# Altium project SM3320-BATT-EV.PrjPCB
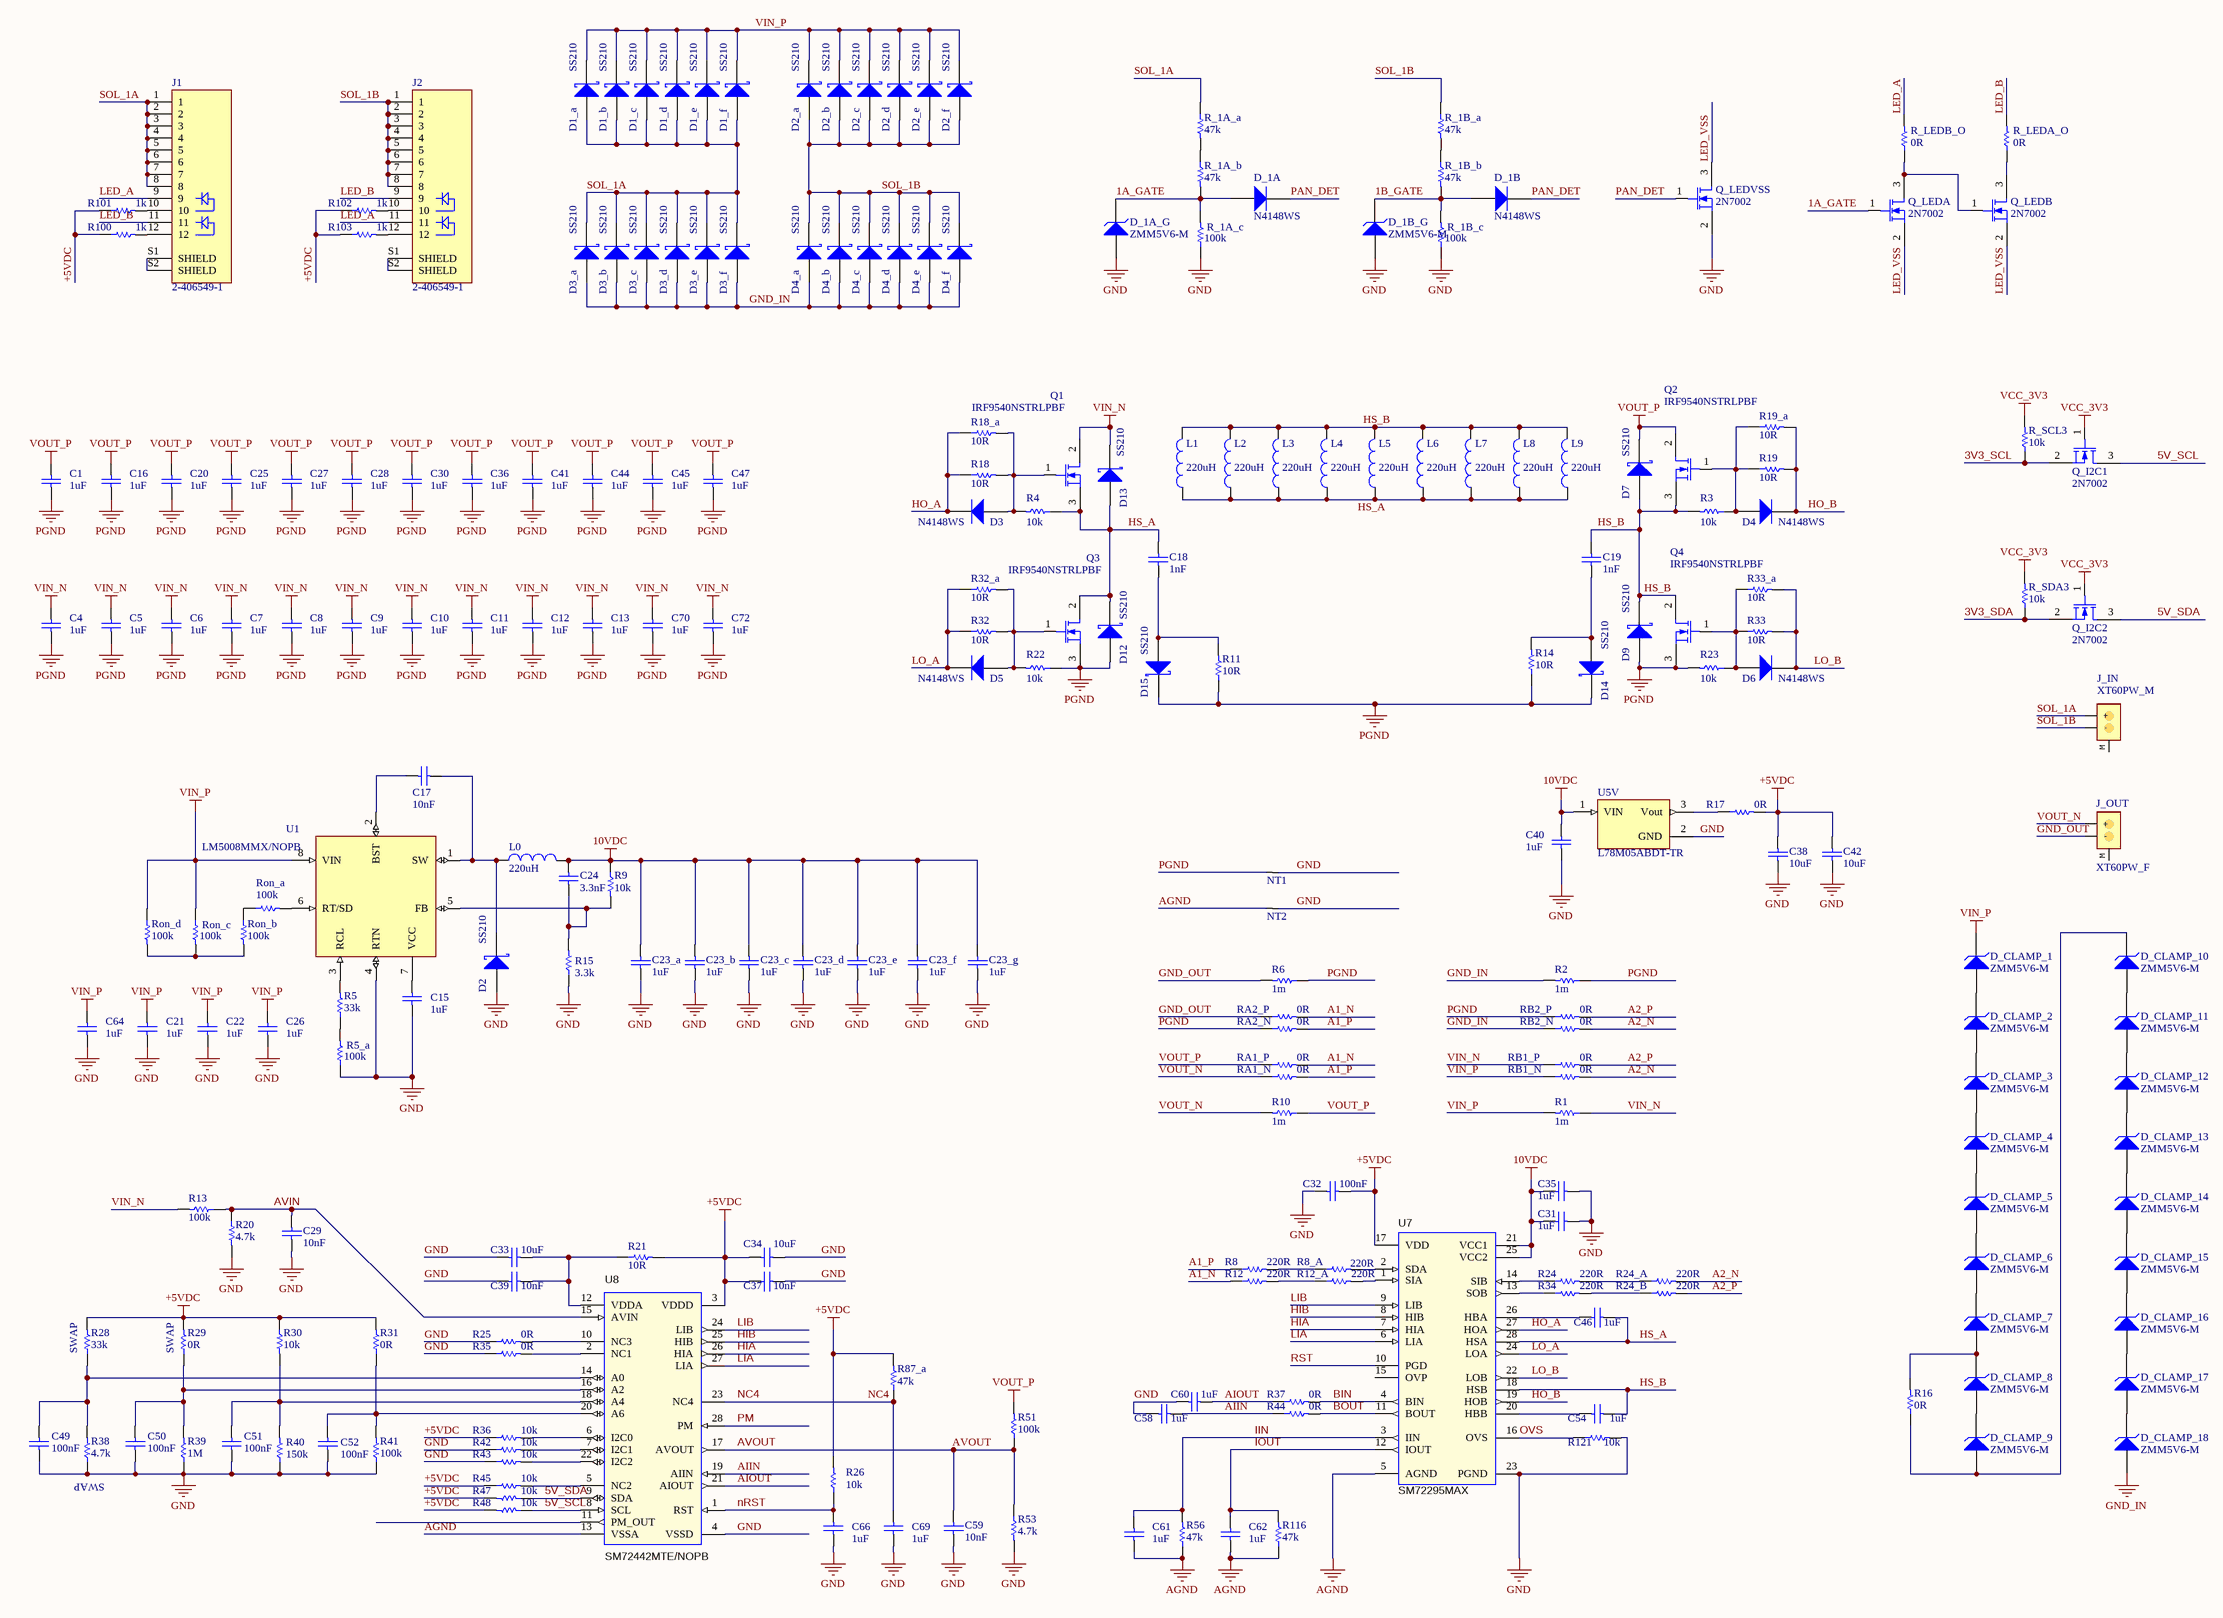
[diagram p0: SM3320-BATT-EV.SchDoc]
PCB_CopperRev: 001; PCB_MinorRev: -001 REV A; PCB_SilkRev: REV A; PRJ_BasePN: 600556; PRJ_Customer: National Semiconductor; PRJ_Title: SM3320-BATT-EV; SCH_Rev: X1; TechSupport: http://www.national.com/support
1 sheet, 236 parts. Net scope: global (net labels, ports and power ports of the same name join across sheets).
Board file: SM3320-BATT-EV.PcbDoc

## Sheet SM3320-BATT-EV.SchDoc: ChangeMe
size C; Date: Not shown in title block; ApprovedBy: Not shown in title block; CheckedBy: Not shown in title block; Author: Not shown in title block; CompanyName: Not shown in title block; DrawnBy: Not shown in title block; Engineer: Not shown in title block; Organization: Not shown in title block; Address1: Not shown in title block; Address2: Not shown in title block; Address3: Not shown in title block; Address4: Not shown in title block; DocumentNumber: 1; Revision: Use project parameter SCH_Rev; SheetNumber: 1; SheetTotal: 1; PageSetup: Record=PageOptions|CenterHorizontal=True|CenterVertical=True|PrintScale=0.85|XCorrection=0.00|YCorrection=0.00|PrintKind=2|BorderSize=5000000|LeftOffset=0|BottomOffset=0|Orientation=2|PaperLength=1000|PaperWidth=1000|Scale=100|PaperSource=15|PrintQuality=600|MediaType=1|DitherType=10|PaperKind=11x17|PrintScaleMode=0; CurrentTime: Not shown in title block; CurrentDate: Not shown in title block; Time: Not shown in title block; DocumentFullPathAndName: Not shown in title block; DocumentName: Not shown in title block; ModifiedDate: Not shown in title block; ImagePath: Not shown in title block

### Parts
C1  value 1uF  [C_1206]  (hidden comment: 1206B105K101NT)
C4  value 1uF  [C_1206]  (hidden comment: 1206B105K101NT)
C5  value 1uF  [C_1206]  (hidden comment: 1206B105K101NT)
C6  value 1uF  [C_1206]  (hidden comment: 1206B105K101NT)
C7  value 1uF  [C_1206]  (hidden comment: 1206B105K101NT)
C8  value 1uF  [C_1206]  (hidden comment: 1206B105K101NT)
C9  value 1uF  [C_1206]  (hidden comment: 1206B105K101NT)
C10  value 1uF  [C_1206]  (hidden comment: 1206B105K101NT)
C11  value 1uF  [C_1206]  (hidden comment: 1206B105K101NT)
C12  value 1uF  [C_1206]  (hidden comment: 1206B105K101NT)
C13  value 1uF  [C_1206]  (hidden comment: 1206B105K101NT)
C15  value 1uF  [C_0402]  (hidden comment: CL05A105KA5NQNC)
C16  value 1uF  [C_1206]  (hidden comment: 1206B105K101NT)
C17  value 10nF  [C_0402]  (hidden comment: CL05B103KB5NNNC)
C18  value 1nF  [C_1206]  (hidden comment: 1206B102K202NT)
C19  value 1nF  [C_1206]  (hidden comment: 1206B102K202NT)
C20  value 1uF  [C_1206]  (hidden comment: 1206B105K101NT)
C21  value 1uF  [C_1206]  (hidden comment: 1206B105K101NT)
C22  value 1uF  [C_1206]  (hidden comment: 1206B105K101NT)
C23_a  value 1uF  [C_0402]  (hidden comment: CL05A105KA5NQNC)
C23_b  value 1uF  [C_0402]  (hidden comment: CL05A105KA5NQNC)
C23_c  value 1uF  [C_0402]  (hidden comment: CL05A105KA5NQNC)
C23_d  value 1uF  [C_0402]  (hidden comment: CL05A105KA5NQNC)
C23_e  value 1uF  [C_0402]  (hidden comment: CL05A105KA5NQNC)
C23_f  value 1uF  [C_0402]  (hidden comment: CL05A105KA5NQNC)
C23_g  value 1uF  [C_0402]  (hidden comment: CL05A105KA5NQNC)
C24  value 3.3nF  [C_0402]  (hidden comment: CL05B332KB5NNNC)
C25  value 1uF  [C_1206]  (hidden comment: 1206B105K101NT)
C26  value 1uF  [C_1206]  (hidden comment: 1206B105K101NT)
C27  value 1uF  [C_1206]  (hidden comment: 1206B105K101NT)
C28  value 1uF  [C_1206]  (hidden comment: 1206B105K101NT)
C29  value 10nF  [C_0402]  (hidden comment: CL05B103KB5NNNC)
C30  value 1uF  [C_1206]  (hidden comment: 1206B105K101NT)
C31  value 1uF  [C_0402]  (hidden comment: CL05A105KA5NQNC)
C32  value 100nF  [C_0402]  (hidden comment: CL05B104KO5NNNC)
C33  value 10uF  [C_0402]  (hidden comment: CL05A106MQ5NUNC)
C34  value 10uF  [C_0402]  (hidden comment: CL05A106MQ5NUNC)
C35  value 1uF  [C_0402]  (hidden comment: CL05A105KA5NQNC)
C36  value 1uF  [C_1206]  (hidden comment: 1206B105K101NT)
C37  value 10nF  [C_0402]  (hidden comment: CL05B103KB5NNNC)
C38  value 10uF  [C_0402]  (hidden comment: CL05A106MQ5NUNC)
C39  value 10nF  [C_0402]  (hidden comment: CL05B103KB5NNNC)
C40  value 1uF  [C_0402]  (hidden comment: CL05A105KA5NQNC)
C41  value 1uF  [C_1206]  (hidden comment: 1206B105K101NT)
C42  value 10uF  [C_0402]  (hidden comment: CL05A106MQ5NUNC)
C44  value 1uF  [C_1206]  (hidden comment: 1206B105K101NT)
C45  value 1uF  [C_1206]  (hidden comment: 1206B105K101NT)
C46  value 1uF  [C_0402]  (hidden comment: CL05A105KA5NQNC)
C47  value 1uF  [C_1206]  (hidden comment: 1206B105K101NT)
C49  value 100nF  [C_0402]  (hidden comment: CL05B104KO5NNNC)
C50  value 100nF  [C_0402]  (hidden comment: CL05B104KO5NNNC)
C51  value 100nF  [C_0402]  (hidden comment: CL05B104KO5NNNC)
C52  value 100nF  [C_0402]  (hidden comment: CL05B104KO5NNNC)
C54  value 1uF  [C_0402]  (hidden comment: CL05A105KA5NQNC)
C58  value 1uF  [C_0402]  (hidden comment: CL05A105KA5NQNC)
C59  value 10nF  [C_0402]  (hidden comment: CL05B103KB5NNNC)
C60  value 1uF  [C_0402]  (hidden comment: CL05A105KA5NQNC)
C61  value 1uF  [C_0402]  (hidden comment: CL05A105KA5NQNC)
C62  value 1uF  [C_0402]  (hidden comment: CL05A105KA5NQNC)
C64  value 1uF  [C_1206]  (hidden comment: 1206B105K101NT)
C66  value 1uF  [C_0402]  (hidden comment: CL05A105KA5NQNC)
C69  value 1uF  [C_0402]  (hidden comment: CL05A105KA5NQNC)
C70  value 1uF  [C_1206]  (hidden comment: 1206B105K101NT)
C72  value 1uF  [C_1206]  (hidden comment: 1206B105K101NT)
D1_a  SS210  [DO-214AC]
D1_b  SS210  [DO-214AC]
D1_c  SS210  [DO-214AC]
D1_d  SS210  [DO-214AC]
D1_e  SS210  [DO-214AC]
D1_f  SS210  [DO-214AC]
D2  SS210  [DO-214AC]
D2_a  SS210  [DO-214AC]
D2_b  SS210  [DO-214AC]
D2_c  SS210  [DO-214AC]
D2_d  SS210  [DO-214AC]
D2_e  SS210  [DO-214AC]
D2_f  SS210  [DO-214AC]
D3  N4148WS  [SOD-323]
D3_a  SS210  [DO-214AC]
D3_b  SS210  [DO-214AC]
D3_c  SS210  [DO-214AC]
D3_d  SS210  [DO-214AC]
D3_e  SS210  [DO-214AC]
D3_f  SS210  [DO-214AC]
D4  N4148WS  [SOD-323]
D4_a  SS210  [DO-214AC]
D4_b  SS210  [DO-214AC]
D4_c  SS210  [DO-214AC]
D4_d  SS210  [DO-214AC]
D4_e  SS210  [DO-214AC]
D4_f  SS210  [DO-214AC]
D5  N4148WS  [SOD-323]
D6  N4148WS  [SOD-323]
D7  SS210  [DO-214AC]
D9  SS210  [DO-214AC]
D12  SS210  [DO-214AC]
D13  SS210  [DO-214AC]
D14  SS210  [DO-214AC]
D15  SS210  [DO-214AC]
D_1A  N4148WS  [SOD-323]
D_1A_G  ZMM5V6-M  [DO-213AA]
D_1B  N4148WS  [SOD-323]
D_1B_G  ZMM5V6-M  [DO-213AA]
D_CLAMP_1  ZMM5V6-M  [DO-213AA]
D_CLAMP_2  ZMM5V6-M  [DO-213AA]
D_CLAMP_3  ZMM5V6-M  [DO-213AA]
D_CLAMP_4  ZMM5V6-M  [DO-213AA]
D_CLAMP_5  ZMM5V6-M  [DO-213AA]
D_CLAMP_6  ZMM5V6-M  [DO-213AA]
D_CLAMP_7  ZMM5V6-M  [DO-213AA]
D_CLAMP_8  ZMM5V6-M  [DO-213AA]
D_CLAMP_9  ZMM5V6-M  [DO-213AA]
D_CLAMP_10  ZMM5V6-M  [DO-213AA]
D_CLAMP_11  ZMM5V6-M  [DO-213AA]
D_CLAMP_12  ZMM5V6-M  [DO-213AA]
D_CLAMP_13  ZMM5V6-M  [DO-213AA]
D_CLAMP_14  ZMM5V6-M  [DO-213AA]
D_CLAMP_15  ZMM5V6-M  [DO-213AA]
D_CLAMP_16  ZMM5V6-M  [DO-213AA]
D_CLAMP_17  ZMM5V6-M  [DO-213AA]
D_CLAMP_18  ZMM5V6-M  [DO-213AA]
J1  2-406549-1  [TE_2-406549-1]
J2  2-406549-1  [TE_2-406549-1]
J_IN  XT60PW_M  [XT60PW_M]
J_OUT  XT60PW_F  [XT60PW_F]
L0  value 220uH  [SRR1260]  (hidden comment: SWRB1207S-221MT)
L1  value 220uH  [SRR1260]  (hidden comment: SWRB1207S-221MT)
L2  value 220uH  [SRR1260]  (hidden comment: SWRB1207S-221MT)
L3  value 220uH  [SRR1260]  (hidden comment: SWRB1207S-221MT)
L4  value 220uH  [SRR1260]  (hidden comment: SWRB1207S-221MT)
L5  value 220uH  [SRR1260]  (hidden comment: SWRB1207S-221MT)
L6  value 220uH  [SRR1260]  (hidden comment: SWRB1207S-221MT)
L7  value 220uH  [SRR1260]  (hidden comment: SWRB1207S-221MT)
L8  value 220uH  [SRR1260]  (hidden comment: SWRB1207S-221MT)
L9  value 220uH  [SRR1260]  (hidden comment: SWRB1207S-221MT)
NT1  0  [NET_TIE]  (value not drawn)
NT2  0  [NET_TIE]  (value not drawn)
Q1  IRF9540NSTRLPBF  [TO-263-3]
Q2  IRF9540NSTRLPBF  [TO-263-3]
Q3  IRF9540NSTRLPBF  [TO-263-3]
Q4  IRF9540NSTRLPBF  [TO-263-3]
Q_I2C1  2N7002  [TO-236AB]
Q_I2C2  2N7002  [TO-236AB]
Q_LEDA  2N7002  [TO-236AB]
Q_LEDB  2N7002  [TO-236AB]
Q_LEDVSS  2N7002  [TO-236AB]
R1  1m  [R_2512]
R2  1m  [R_2512]
R3  value 10k  [R_0402]  (hidden comment: 0402WGF1002TCE)
R4  value 10k  [R_0402]  (hidden comment: 0402WGF1002TCE)
R5  value 33k  [R_0402]  (hidden comment: 0402WGF3302TCE)
R5_a  value 100k  [R_0402]  (hidden comment: 0402WGF1003TCE)
R6  1m  [R_2512]
R8  value 220R  [R_0402]  (hidden comment: 0402WGF2200TCE)
R8_A  value 220R  [R_0402]  (hidden comment: *)
R9  value 10k  [R_0402]  (hidden comment: 0402WGF1002TCE)
R10  1m  [R_2512]
R11  value 10R  [R_1206]  (hidden comment: 1206W4F100JT5E)
R12  value 220R  [R_0402]  (hidden comment: 0402WGF2200TCE)
R12_A  value 220R  [R_0402]  (hidden comment: 0402WGF2200TCE)
R13  value 100k  [R_0603]  (hidden comment: 0603WAF100KT5E)
R14  value 10R  [R_1206]  (hidden comment: 1206W4F100JT5E)
R15  value 3.3k  [R_0402]  (hidden comment: 0402WGF3301TCE)
R16  value 0R  [R_0402]  (hidden comment: 0402WGF0000TCE)
R17  value 0R  [R_0402]  (hidden comment: 0402WGF0000TCE)
R18  value 10R  [R_0402]  (hidden comment: 0402WGF100JTCE)
R18_a  value 10R  [R_0402]  (hidden comment: 0402WGF100JTCE)
R19  value 10R  [R_0402]  (hidden comment: 0402WGF100JTCE)
R19_a  value 10R  [R_0402]  (hidden comment: 0402WGF100JTCE)
R20  value 4.7k  [R_0402]  (hidden comment: 0402WGF4701TCE)
R21  value 10R  [R_0402]  (hidden comment: 0402WGF100JTCE)
R22  value 10k  [R_0402]  (hidden comment: 0402WGF1002TCE)
R23  value 10k  [R_0402]  (hidden comment: 0402WGF1002TCE)
R24  value 220R  [R_0402]  (hidden comment: 0402WGF2200TCE)
R24_A  value 220R  [R_0402]  (hidden comment: 0402WGF2200TCE)
R24_B  value 220R  [R_0402]  (hidden comment: 0402WGF2200TCE)
R25  value 0R  [R_0402]  (hidden comment: 0402WGF0000TCE)
R26  value 10k  [R_0402]  (hidden comment: 0402WGF1002TCE)
R28  value 33k  [R_0402]  (hidden comment: 0402WGF3302TCE)
R29  value 0R  [R_0402]  (hidden comment: 0402WGF0000TCE)
R30  value 10k  [R_0402]  (hidden comment: 0402WGF1002TCE)
R31  value 0R  [R_0402]  (hidden comment: 0402WGF0000TCE)
R32  value 10R  [R_0402]  (hidden comment: 0402WGF100JTCE)
R32_a  value 10R  [R_0402]  (hidden comment: 0402WGF100JTCE)
R33  value 10R  [R_0402]  (hidden comment: 0402WGF100JTCE)
R33_a  value 10R  [R_0402]  (hidden comment: 0402WGF100JTCE)
R34  value 220R  [R_0402]  (hidden comment: 0402WGF2200TCE)
R35  value 0R  [R_0402]  (hidden comment: 0402WGF0000TCE)
R36  value 10k  [R_0402]  (hidden comment: 0402WGF1002TCE)
R37  value 0R  [R_0402]  (hidden comment: 0402WGF0000TCE)
R38  value 4.7k  [R_0402]  (hidden comment: 0402WGF4701TCE)
R39  value 1M  [R_0402]  (hidden comment: 0402WGF1004TCE)
R40  value 150k  [R_0402]  (hidden comment: 0402WGF1503TCE)
R41  value 100k  [R_0402]  (hidden comment: 0402WGF1003TCE)
R42  value 10k  [R_0402]  (hidden comment: 0402WGF1002TCE)
R43  value 10k  [R_0402]  (hidden comment: 0402WGF1002TCE)
R44  value 0R  [R_0402]  (hidden comment: 0402WGF0000TCE)
R45  value 10k  [R_0402]  (hidden comment: 0402WGF1002TCE)
R47  value 10k  [R_0402]  (hidden comment: 0402WGF1002TCE)
R48  value 10k  [R_0402]  (hidden comment: 0402WGF1002TCE)
R51  value 100k  [R_0603]  (hidden comment: 0603WAF100KT5E)
R53  value 4.7k  [R_0402]  (hidden comment: 0402WGF4701TCE)
R56  value 47k  [R_0402]  (hidden comment: 0402WGF4702TCE)
R87_a  value 47k  [R_0402]  (hidden comment: 0402WGF4702TCE)
R100  value 1k  [R_0402]  (hidden comment: 0402WGF1001TCE)
R101  value 1k  [R_0402]  (hidden comment: 0402WGF1001TCE)
R102  value 1k  [R_0402]  (hidden comment: 0402WGF1001TCE)
R103  value 1k  [R_0402]  (hidden comment: 0402WGF1001TCE)
R116  value 47k  [R_0402]  (hidden comment: 0402WGF4702TCE)
R121  value 10k  [R_0402]  (hidden comment: 0402WGF1002TCE)
R_1A_a  value 47k  [R_0402]  (hidden comment: 0402WGF4702TCE)
R_1A_b  value 47k  [R_0402]  (hidden comment: 0402WGF4702TCE)
R_1A_c  value 100k  [R_0402]  (hidden comment: 0402WGF1003TCE)
R_1B_a  value 47k  [R_0402]  (hidden comment: 0402WGF4702TCE)
R_1B_b  value 47k  [R_0402]  (hidden comment: 0402WGF4702TCE)
R_1B_c  value 100k  [R_0402]  (hidden comment: 0402WGF1003TCE)
R_LEDA_O  value 0R  [R_0402]  (hidden comment: 0402WGF0000TCE)
R_LEDB_O  value 0R  [R_0402]  (hidden comment: 0402WGF0000TCE)
R_SCL3  value 10k  [R_0402]  (hidden comment: 0402WGF1002TCE)
R_SDA3  value 10k  [R_0402]  (hidden comment: 0402WGF1002TCE)
RA1_N  value 0R  [R_0402]  (hidden comment: 0402WGF0000TCE)
RA1_P  value 0R  [R_0402]  (hidden comment: 0402WGF0000TCE)
RA2_N  value 0R  [R_0402]  (hidden comment: 0402WGF0000TCE)
RA2_P  value 0R  [R_0402]  (hidden comment: 0402WGF0000TCE)
RB1_N  value 0R  [R_0402]  (hidden comment: 0402WGF0000TCE)
RB1_P  value 0R  [R_0402]  (hidden comment: 0402WGF0000TCE)
RB2_N  value 0R  [R_0402]  (hidden comment: 0402WGF0000TCE)
RB2_P  value 0R  [R_0402]  (hidden comment: 0402WGF0000TCE)
Ron_a  value 100k  [R_0402]  (hidden comment: 0402WGF1003TCE)
Ron_b  value 100k  [R_0402]  (hidden comment: 0402WGF1003TCE)
Ron_c  value 100k  [R_0402]  (hidden comment: 0402WGF1003TCE)
Ron_d  value 100k  [R_0402]  (hidden comment: 0402WGF1003TCE)
U1  LM5008MMX/NOPB  [SOP65P490X110-8N]
U5V  L78M05ABDT-TR  [TO-252AA]
U7  SM72295MAX  [M28B_M]
U8  SM72442MTE/NOPB  [MTC28_L]

### Nets
10VDC: C23_a.1 C23_b.1 C23_c.1 C23_d.1 C23_e.1 C23_f.1 C23_g.1 C24.2 C31.1 C35.1 C40.2 L0.2 R9.1 U5V.1(VIN) U7.21(VCC1) U7.25(VCC2)
+5VDC: C32.2 C34.2 C37.1 C38.2 C42.2 R17.2 R21.2 R26.2 R28.2 R29.2 R30.1 R31.2 R36.1 R45.1 R47.2 R48.2 R87_a.2 R100.1 R101.1 R102.1 R103.1 U7.17(VDD) U8.3(VDDD)
AGND: C61.1 C62.1 NT2.1 R56.1 R116.1 U7.5(AGND) U8.13(VSSA)
GND: C15.2 C21.1 C22.1 C23_a.2 C23_b.2 C23_c.2 C23_d.2 C23_e.2 C23_f.2 C23_g.2 C26.1 C29.1 C31.2 C32.1 C33.2 C34.1 C35.2 C37.2 C38.1 C39.1 C40.1 C42.1 C49.1 C50.1 C51.1 C52.2 C58.1 C59.1 C60.1 C64.1 C66.1 C69.1 D2.2(A) D_1A_G.2(A) D_1B_G.2(A) NT1.2 NT2.2 Q_LEDVSS.2(S) R5_a.1 R15.1 R20.2 R25.1 R35.1 R38.1 R39.1 R40.1 R41.1 R42.1 R43.1 R53.2 R121.2 R_1A_c.1 R_1B_c.1 U1.4(RTN) U5V.2(GND) U7.23(PGND) U8.4(VSSD)
GND_IN: D3_a.2(A) D3_b.2(A) D3_c.2(A) D3_d.2(A) D3_e.2(A) D3_f.2(A) D4_a.2(A) D4_b.2(A) D4_c.2(A) D4_d.2(A) D4_e.2(A) D4_f.2(A) D_CLAMP_18.2(A) R2.2 RB2_N.1
PGND: C1.1 C4.1 C5.1 C6.1 C7.1 C8.1 C9.1 C10.1 C11.1 C12.1 C13.1 C16.1 C20.1 C25.1 C27.1 C28.1 C30.1 C36.1 C41.1 C44.1 C45.1 C47.1 C70.1 C72.1 D9.2(A) D12.2(A) D14.1(K) D15.1(K) NT1.1 Q3.3(S) Q4.3(S) R2.1 R6.1 R11.1 R14.1 R22.1 R23.2 RA2_N.1 RB2_P.1
VCC_3V3: Q_I2C1.1(G) Q_I2C2.1(G) R_SCL3.2 R_SDA3.2
VIN_N: C4.2 C5.2 C6.2 C7.2 C8.2 C9.2 C10.2 C11.2 C12.2 C13.2 C70.2 C72.2 D13.1(K) Q1.2(D) R1.1 R13.2 RB1_P.1
VIN_P: C21.2 C22.2 C26.2 C64.2 D1_a.1(K) D1_b.1(K) D1_c.1(K) D1_d.1(K) D1_e.1(K) D1_f.1(K) D2_a.1(K) D2_b.1(K) D2_c.1(K) D2_d.1(K) D2_e.1(K) D2_f.1(K) D_CLAMP_1.1(K) R1.2 RB1_N.1 Ron_c.1 Ron_d.1 U1.8(VIN)
VOUT_P: C1.2 C16.2 C20.2 C25.2 C27.2 C28.2 C30.2 C36.2 C41.2 C44.2 C45.2 C47.2 D7.1(K) Q2.2(D) R10.1 R51.2 RA1_P.1
1A_GATE: D_1A.2(A) D_1A_G.1(K) Q_LEDA.1(G) R_1A_b.2 R_1A_c.2
1B_GATE: D_1B.2(A) D_1B_G.1(K) R_1B_b.2 R_1B_c.2
3V3_SCL: Q_I2C1.2(S) R_SCL3.1
3V3_SDA: Q_I2C2.2(S) R_SDA3.1
5V_SCL: Q_I2C1.3(D) R48.1 U8.8(SCL)
5V_SDA: Q_I2C2.3(D) R47.1 U8.9(SDA)
A1_N: R12.1 RA1_P.2 RA2_P.2
A1_P: R8.1 RA1_N.2 RA2_N.2
A2_N: R24_A.2 RB1_N.2 RB2_N.2
A2_P: R24_B.2 RB1_P.2 RB2_P.2
AIIN: C58.2 R44.1 U8.19(AIIN)
AIOUT: C60.2 R37.1 U8.21(AIOUT)
AVIN: C29.2 R13.1 R20.1 U8.15(AVIN)
AVOUT: C59.2 R51.1 R53.1 U8.17(AVOUT)
BIN: R37.2 U7.4(BIN)
BOUT: R44.2 U7.11(BOUT)
GND_OUT: J_OUT.MINUS(-) R6.2 RA2_P.1
HIA: U7.7(HIA) U8.26(HIA)
HIB: U7.8(HIB) U8.25(HIB)
HO_A: D3.1(K) R18.1 R18_a.1 U7.27(HOA)
HO_B: D4.1(K) R19.2 R19_a.2 U7.19(HOB)
HS_A: C18.2 C46.2 D12.1(K) D13.2(A) L1.1 L2.1 L3.1 L4.1 L5.1 L6.1 L7.1 L8.1 L9.1 Q1.3(S) Q3.2(D) R4.1 U7.28(HSA)
HS_B: C19.2 C54.2 D7.2(A) D9.1(K) L1.2 L2.2 L3.2 L4.2 L5.2 L6.2 L7.2 L8.2 L9.2 Q2.3(S) Q4.2(D) R3.2 U7.18(HSB)
IIN: C61.2 R56.2 U7.3(IIN)
IOUT: C62.2 R116.2 U7.12(IOUT)
LED_A: J1.9 J2.11 R_LEDB_O.2
LED_B: J1.11 J2.9 R_LEDA_O.2
LED_VSS: Q_LEDA.2(S) Q_LEDB.2(S) Q_LEDVSS.3(D)
LIA: U7.6(LIA) U8.27(LIA)
LIB: U7.9(LIB) U8.24(LIB)
LO_A: D5.1(K) R32.1 R32_a.1 U7.24(LOA)
LO_B: D6.1(K) R33.2 R33_a.2 U7.22(LOB)
NC4: C69.2 R87_a.1 U8.23(NC4)
nRST: C66.2 R26.1 U8.1(RST)
OVS: R121.1 U7.16(OVS)
PAN_DET: D_1A.1(K) D_1B.1(K) Q_LEDVSS.1(G)
PM: U8.28(PM)
RST: U7.10(PGD)
SOL_1A: D1_a.2(A) D1_b.2(A) D1_c.2(A) D1_d.2(A) D1_e.2(A) D1_f.2(A) D3_a.1(K) D3_b.1(K) D3_c.1(K) D3_d.1(K) D3_e.1(K) D3_f.1(K) J1.1 J1.2 J1.3 J1.4 J1.5 J1.6 J1.7 J1.8 J_IN.PLUS(+) R_1A_a.1
SOL_1B: D2_a.2(A) D2_b.2(A) D2_c.2(A) D2_d.2(A) D2_e.2(A) D2_f.2(A) D4_a.1(K) D4_b.1(K) D4_c.1(K) D4_d.1(K) D4_e.1(K) D4_f.1(K) J2.1 J2.2 J2.3 J2.4 J2.5 J2.6 J2.7 J2.8 J_IN.MINUS(-) R_1B_a.1
VOUT_N: J_OUT.PLUS(+) R10.2 RA1_N.1
NetC15_1: C15.1 U1.7(VCC)
NetC17_1: C17.1 U1.2(BST)
NetC17_2: C17.2 D2.1(K) L0.1 U1.1(SW)
NetC18_1: C18.1 D15.2(A) R11.2
NetC19_1: C19.1 D14.2(A) R14.2
NetC24_1: C24.1 R9.2 R15.2 U1.5(FB)
NetC33_1: C33.1 C39.2 R21.1 U8.12(VDDA)
NetC46_1: C46.1 U7.26(HBA)
NetC49_2: C49.2 R28.1 R38.2 U8.14(A0)
NetC50_2: C50.2 R29.1 R39.2 U8.16(A2)
NetC51_2: C51.2 R30.2 R40.2 U8.18(A4)
NetC52_1: C52.1 R31.1 R41.2 U8.20(A6)
NetC54_1: C54.1 U7.20(HBB)
NetD3_2: D3.2(A) Q1.1(G) R4.2 R18.2 R18_a.2
NetD4_2: D4.2(A) Q2.1(G) R3.1 R19.1 R19_a.1
NetD5_2: D5.2(A) Q3.1(G) R22.2 R32.2 R32_a.2
NetD6_2: D6.2(A) Q4.1(G) R23.1 R33.1 R33_a.1
NetD_CLAMP_1_2: D_CLAMP_1.2(A) D_CLAMP_2.1(K)
NetD_CLAMP_2_2: D_CLAMP_2.2(A) D_CLAMP_3.1(K)
NetD_CLAMP_3_2: D_CLAMP_3.2(A) D_CLAMP_4.1(K)
NetD_CLAMP_4_2: D_CLAMP_4.2(A) D_CLAMP_5.1(K)
NetD_CLAMP_5_2: D_CLAMP_5.2(A) D_CLAMP_6.1(K)
NetD_CLAMP_6_2: D_CLAMP_6.2(A) D_CLAMP_7.1(K)
NetD_CLAMP_7_2: D_CLAMP_7.2(A) D_CLAMP_8.1(K) R16.2
NetD_CLAMP_8_2: D_CLAMP_8.2(A) D_CLAMP_9.1(K)
NetD_CLAMP_9_2: D_CLAMP_9.2(A) D_CLAMP_10.1(K) R16.1
NetD_CLAMP_10_2: D_CLAMP_10.2(A) D_CLAMP_11.1(K)
NetD_CLAMP_11_2: D_CLAMP_11.2(A) D_CLAMP_12.1(K)
NetD_CLAMP_12_2: D_CLAMP_12.2(A) D_CLAMP_13.1(K)
NetD_CLAMP_13_2: D_CLAMP_13.2(A) D_CLAMP_14.1(K)
NetD_CLAMP_14_2: D_CLAMP_14.2(A) D_CLAMP_15.1(K)
NetD_CLAMP_15_2: D_CLAMP_15.2(A) D_CLAMP_16.1(K)
NetD_CLAMP_16_2: D_CLAMP_16.2(A) D_CLAMP_17.1(K)
NetD_CLAMP_17_2: D_CLAMP_17.2(A) D_CLAMP_18.1(K)
NetJ1_10: J1.10 R101.2
NetJ1_12: J1.12 R100.2
NetJ1_S1: J1.S1(SHIELD) J1.S2(SHIELD)
NetJ2_10: J2.10 R102.2
NetJ2_12: J2.12 R103.2
NetJ2_S1: J2.S1(SHIELD) J2.S2(SHIELD)
NetQ_LEDA_3: Q_LEDA.3(D) Q_LEDB.1(G) R_LEDB_O.1
NetQ_LEDB_3: Q_LEDB.3(D) R_LEDA_O.1
NetR5_1: R5.1 R5_a.2
NetR5_2: R5.2 U1.3(RCL)
NetR8_2: R8.2 R8_A.1
NetR8_A_2: R8_A.2 U7.2(SDA)
NetR12_2: R12.2 R12_A.1
NetR12_A_2: R12_A.2 U7.1(SIA)
NetR17_1: R17.1 U5V.3(Vout)
NetR24_1: R24.1 U7.14(SIB)
NetR24_2: R24.2 R24_A.1
NetR24_B_1: R24_B.1 R34.2
NetR25_2: R25.2 U8.10(NC3)
NetR34_1: R34.1 U7.13(SOB)
NetR35_2: R35.2 U8.2(NC1)
NetR36_2: R36.2 U8.6(I2C0)
NetR42_2: R42.2 U8.7(I2C1)
NetR43_2: R43.2 U8.22(I2C2)
NetR45_2: R45.2 U8.5(NC2)
NetR_1A_a_2: R_1A_a.2 R_1A_b.1
NetR_1B_a_2: R_1B_a.2 R_1B_b.1
NetRon_a_1: Ron_a.1 Ron_b.1
NetRon_a_2: Ron_a.2 U1.6(RT/SD)
NetRon_b_2: Ron_b.2 Ron_c.2 Ron_d.2

Not connected (* = marked no-connect by the designer): J_IN M; J_OUT M; U7 15(OVP); U8 11(PM_OUT)

### Notes on the sheet
- (near R28) SWAP
- (near R29) SWAP
- (near R38) SWAP
- Title
- Size:
- Date:
- File:
- C
- Number:
- Time:
- Revision:
- Sheet
- of

### Library data of the parts
C1 C4-C13 C16 C20-C22 C25-C28 C30 C36 C41 C44 C45 C47 C64 C70 C72 = 1206B105K101NT: C - CAPACITOR - MLCC - 1uF - 100V - 1206 - X7R; WVDC: 100; LCSC Part #: C91151; JLC Availability: Extended
C15 C23_a C23_b C23_c C23_d C23_e C23_f C23_g C31 C35 C40 C46 C54 C58 C60-C62 C66 C69 = CL05A105KA5NQNC: C - CAPACITOR - MLCC - 1uF - 25V - 0402; WVDC: 16; LCSC Part #: C52923; JLC Availability: Basic
C17 C29 C37 C39 C59 = CL05B103KB5NNNC: C - CAPACITOR - MLCC - 10nF - 50V - 0402; WVDC: 50; LCSC Part #: C15195; JLC Availability: Basic
C18 C19 = 1206B102K202NT: C - CAPACITOR - MLCC - 1nF - 2000V - 1206 - X7R; WVDC: 2000; LCSC Part #: C9196; JLC Availability: Basic
C24 = CL05B332KB5NNNC: C - CAPACITOR - MLCC - 3.3nF - 50V - 0402; WVDC: 50; LCSC Part #: C26404; JLC Availability: Basic
C32 C49-C52 = CL05B104KO5NNNC: C - CAPACITOR - MLCC - 100nF - 16V - 0402; WVDC: 16; LCSC Part #: C1525; JLC Availability: Basic
C33 C34 C38 C42 = CL05A106MQ5NUNC: C - CAPACITOR - MLCC - 10uF - 6.3V - 0402; WVDC: 6.3; LCSC Part #: C15525; JLC Availability: Basic
D1_a D1_b D1_c D1_d D1_e D1_f D2 D2_a D2_b D2_c D2_d D2_e D2_f D3_a D3_b D3_c D3_d D3_e D3_f D4_a D4_b D4_c D4_d D4_e D4_f D7 D9 D12-D15 = SS210: D - DIODE - SCHOTTKY - 100V - 2A; Vrrm: 100; If: 2A; LCSC Part #: C14996; JLC Availability: Extended
D3-D6 D_1A D_1B = N4148WS: D - DIODE - FAST TRR - 100V - 150mA - 4ns; LCSC Part #: C2128; JLC Availability: Basic; PIV: 100V; If: 150mA; Trr: 4ns
D_1A_G D_1B_G D_CLAMP_1-D_CLAMP_18 = ZMM5V6-M: D - DIODE - ZENER - 5.6V - 500mW; LCSC Part #: C8062; JLC Availability: BASIC
J1 J2 = 2-406549-1: J - JACK - ETHERNET - Right - THT; LCSC Part #: C125068; JLC Availability: Extended
J_IN = XT60PW_M: J - JACK - POWER - XT60 - RIGHT - MALE; LCSC Part #: X; JLC Availability: None
J_OUT = XT60PW_F: J - JACK - POWER - XT60 - RIGHT - FEMALE; LCSC Part #: X; JLC Availability: None
L0-L9 = SWRB1207S-221MT: L - INDUCTOR - 220uH - 1.6A - 12.5mm; Isat: 1.6A; LCSC Part #: C169380; JLC Availability: Extended
NT1 NT2 = NET_TIE: R - Net Tie
Q1-Q4 = IRF9540NSTRLPBF: Q - TRANSISTOR - MOSFET (N) - 250V - 33A - 0.094R; WVDC: 100; LCSC Part #: C33903; JLC Availability: Extended
Q_I2C1 Q_I2C2 Q_LEDA Q_LEDB Q_LEDVSS = 2N7002: Q - TRANSISTOR - MOSFET (N) - 60V - 200mW; WVDC: 60; JLC Availability: Basic; LCSC Part #: C8545
R1 R2 R6 R10 = EWSL2512F1L00S9: R - RESISTOR - SMD - 0.001R - 1% - 2512 - 2W - 50ppm/k; LCSC Part #: C349153; JLC Availability: Extended; ComponentLink1URL: http://riedon.com/media/pdf/CSR.pdf; ComponentLink1Description: http://riedon.com/media/pdf/CSR.pdf; Power: 2W
R3 R4 R9 R22 R23 R26 R30 R36 R42 R43 R45 R47 R48 R121 R_SCL3 R_SDA3 = 0402WGF1002TCE: R - RESISTOR - SMD - 10k - 1% - 0402; LCSC Part #: C25744; JLC Availability: Basic
R5 R28 = 0402WGF3302TCE: R - RESISTOR - SMD - 33k - 1% - 0402; LCSC Part #: C25779; JLC Availability: Basic
R5_a R41 R_1A_c R_1B_c Ron_a Ron_b Ron_c Ron_d = 0402WGF1003TCE: R - RESISTOR - SMD - 100k - 1% -  0402; LCSC Part #: C25741; JLC Availability: Basic
R8 R12 R12_A R24 R24_A R24_B R34 = 0402WGF2200TCE: R - RESISTOR - SMD - 220R - 1% - 0402; LCSC Part #: C25091; JLC Availability: Basic
R8_A = ERJ-2RKF2202X: R - RESISTOR - SMD - 220R - 1% - 0402; LCSC Part #: C25091; JLC Availability: Basic
R11 R14 = 1206W4F100JT5E: R - RESISTOR - SMD - 10R - 1% - 1206; LCSC Part #: C17903; JLC Availability: Basic
R13 R51 = 0603WAF100KT5E: R - RESISTOR - SMD - 100k - 1% -  0603; LCSC Part #: C22936; JLC Availability: Basic
R15 = 0402WGF3301TCE: R - RESISTOR - SMD - 3.3k - 1% - 0402; LCSC Part #: C25890; JLC Availability: Basic
R16 R17 R25 R29 R31 R35 R37 R44 R_LEDA_O R_LEDB_O RA1_N RA1_P RA2_N RA2_P RB1_N RB1_P RB2_N RB2_P = 0402WGF0000TCE: R - RESISTOR - SMD - 0R - 1% - 0402; LCSC Part #: C17168; JLC Availability: Basic
R18 R18_a R19 R19_a R21 R32 R32_a R33 R33_a = 0402WGF100JTCE: R - RESISTOR - SMD - 10R - 1% - 0402; LCSC Part #: C25077; JLC Availability: Basic
R20 R38 R53 = 0402WGF4701TCE: R - RESISTOR - SMD - 4.7k - 1% - 0402; LCSC Part #: C25900; JLC Availability: Basic
R39 = 0402WGF1004TCE: R - RESISTOR - SMD - 1M - 1% - 0402; LCSC Part #: C26083; JLC Availability: Basic
R40 = 0402WGF1503TCE: R - RESISTOR - SMD - 150k - 1% - 0402; LCSC Part #: C25755; JLC Availability: Basic
R56 R87_a R116 R_1A_a R_1A_b R_1B_a R_1B_b = 0402WGF4702TCE: R - RESISTOR - SMD - 47k - 1% - 0402; LCSC Part #: C25792; JLC Availability: Basic
R100-R103 = 0402WGF1001TCE: R - RESISTOR - SMD - 1k - 1% - 0402; LCSC Part #: C11702; JLC Availability: Basic
U1 = LM5008MMX/NOPB: U - IC - BUCK CONVERTER, ADJUSTABLE, 95V, 350mA; Package: None; Price: None; Value: *; MP: LM5008MMX/NOPB; Availability: Unavailable
U5V = L78M05ABDT-TR: U - IC - 5V Power Regulator; VOut: 5.0; LCSC Part #: C58069; JLC Availability: Basic
U7 = SM72295: Photovoltaic Full Bridge Driver; Manufacturer: National Semiconductor; PackageTopMarking: S13051; ComponentLink1Description: Solar Magic Website; ComponentLink1URL: http://www.solarmagic.com; CompType: Driver; PackageReference: M28B_N; PartNumber: SM72295; RoHS: Y; PinCount: 28; PackageDescription: SOIC-28
U8 = SM72442: Programmable Maximum Power Point Tracking Controller for Photovoltaic Solar Panels; Manufacturer: National Semiconductor; CompType: MPPT Controller; PackageTopMarking: S02442; RoHS: Y; PartNumber: SM72442; PackageReference: MTC28_L; ComponentLink1Description: Solar Magic Website; ComponentLink1URL: http://www.solarmagic.com; PackageDescription: TSSOP-28; PinCount: 28